# EAGLE design Mouse-112 (EAGLE 9.6.2)
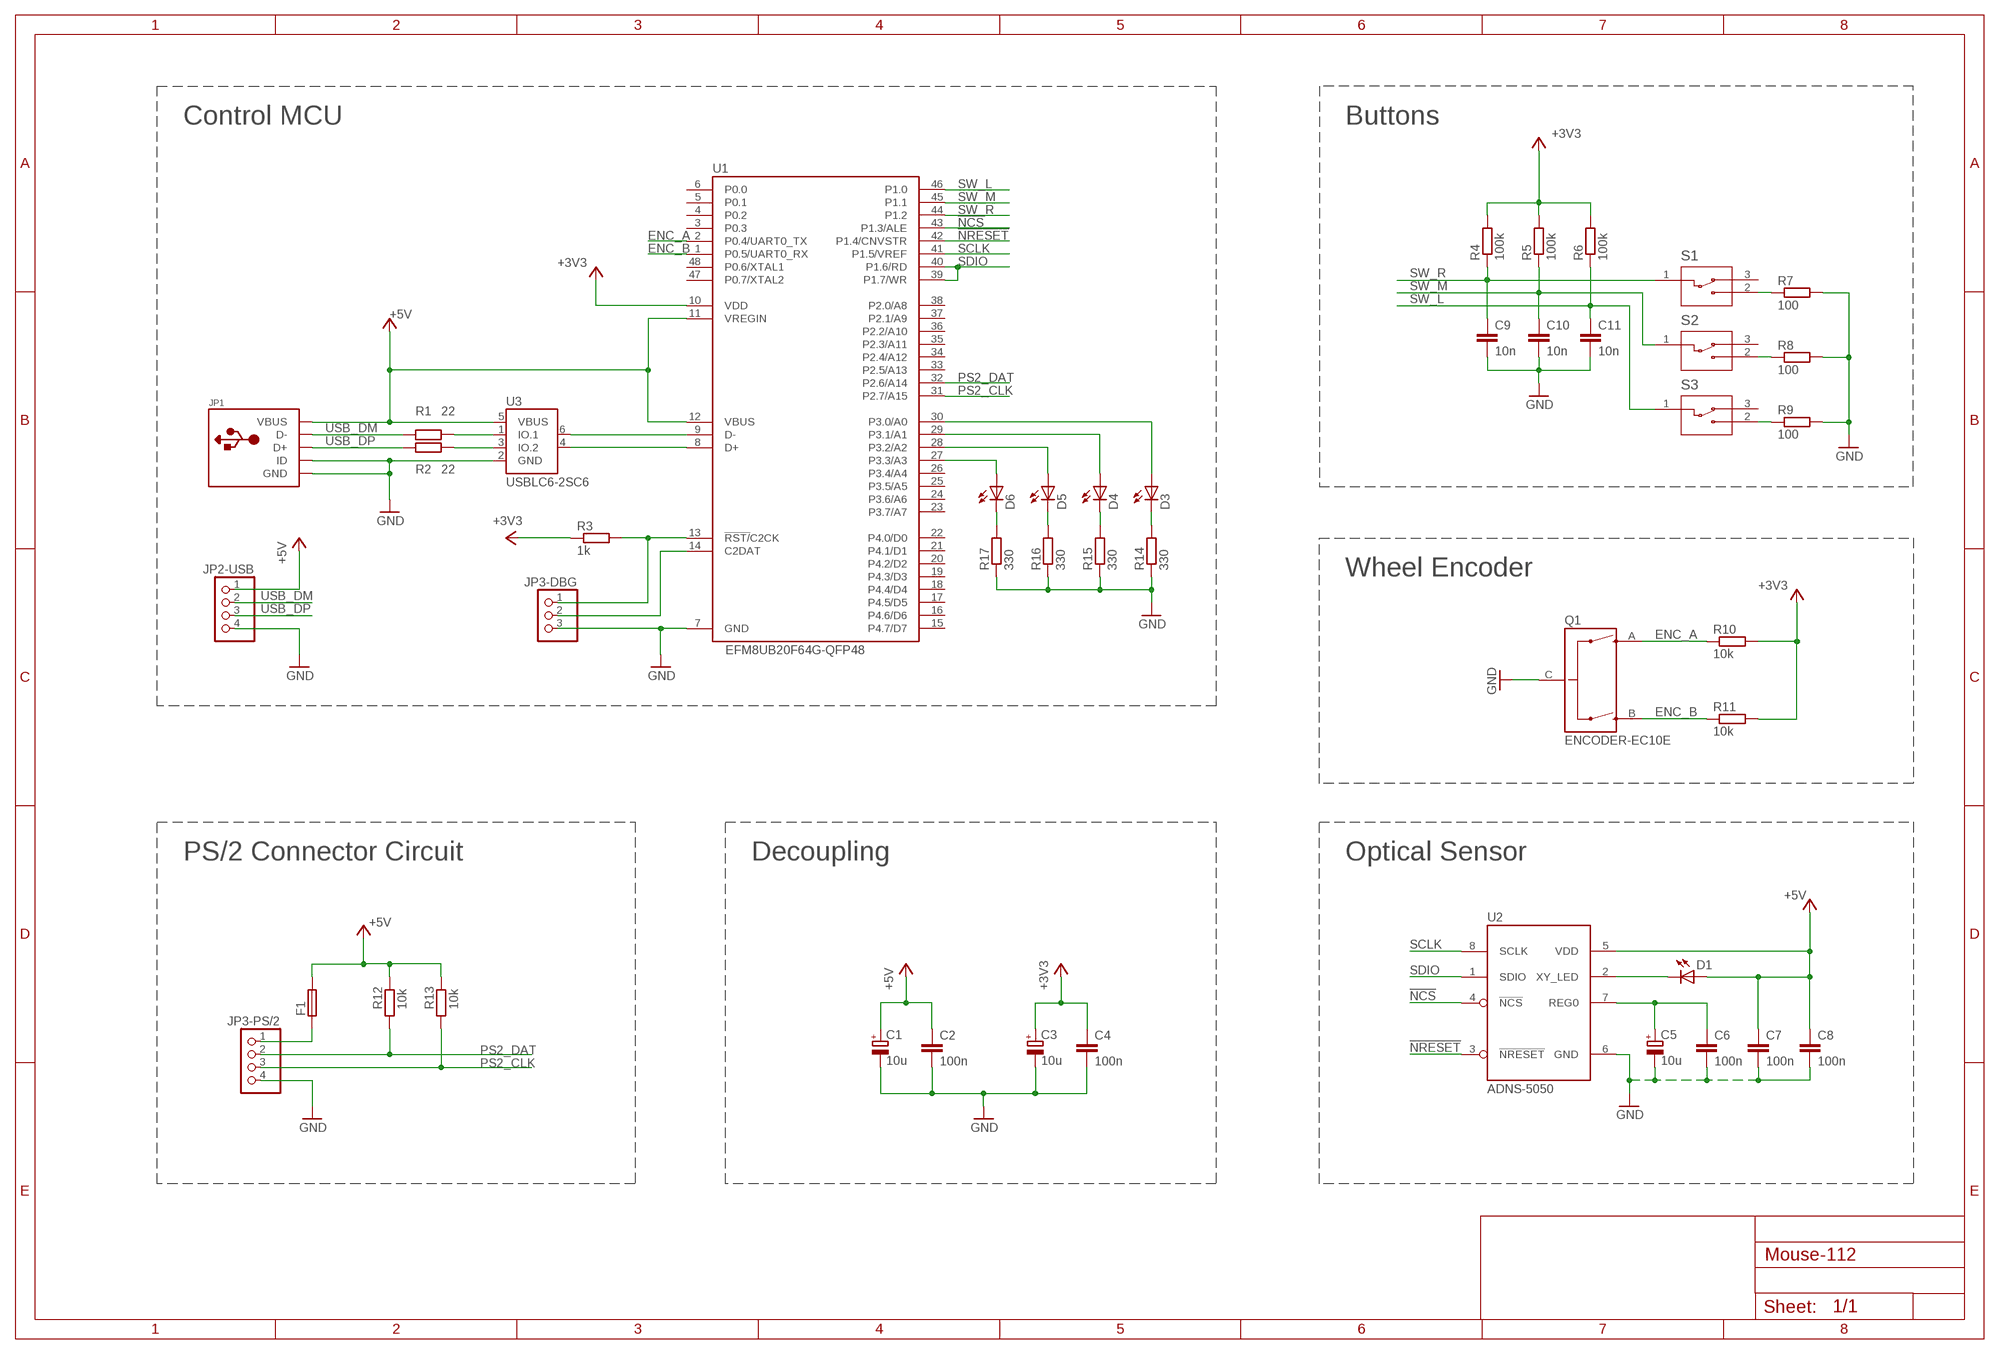
[diagram p0: schematic, sheet 1]

## Parts
C1  10u  CPOL-EU  [RCL-1206F-POL]
C2  100n  C-EU0805  [RCL-0805F]
C3  10u  CPOL-EU  [RCL-1206F-POL]
C4  100n  C-EU0805  [RCL-0805F]
C5  10u  CPOL-EU  [RCL-1206F-POL]
C6  100n  C-EU0805  [RCL-0805F]
C7  100n  C-EU0805  [RCL-0805F]
C8  100n  C-EU0805  [RCL-0805F]
C9  10n  C-EU0805  [RCL-0805F]
C10  10n  C-EU0805  [RCL-0805F]
C11  10n  C-EU0805  [RCL-0805F]
D1  LED5MM  [LED5MM]
D3  LEDLED-0805F  [LED-0805F]
D4  LEDLED-0805F  [LED-0805F]
D5  LEDLED-0805F  [LED-0805F]
D6  LEDLED-0805F  [LED-0805F]
F1  FUSE-NSMF  [RCL-1206F]
JP1  USB-MINI  [USB-MINIB]
JP2-USB  PINHD-1X4  [1X04]
JP3-DBG  PINHD-1X3  [1X03]
JP3-PS/2  PINHD-1X4  [1X04]
Q1  ENCODER-EC10E  [ENCODER-10MM]
R1  22  R-EU0805  [RCL-0805F]
R2  22  R-EU0805  [RCL-0805F]
R3  1k  R-EU0805  [RCL-0805F]
R4  100k  R-EU0805  [RCL-0805F]
R5  100k  R-EU0805  [RCL-0805F]
R6  100k  R-EU0805  [RCL-0805F]
R7  100  R-EU0805  [RCL-0805F]
R8  100  R-EU0805  [RCL-0805F]
R9  100  R-EU0805  [RCL-0805F]
R10  10k  R-EU0805  [RCL-0805F]
R11  10k  R-EU0805  [RCL-0805F]
R12  10k  R-EU0805  [RCL-0805F]
R13  10k  R-EU0805  [RCL-0805F]
R14  330  R-EU0805  [RCL-0805F]
R15  330  R-EU0805  [RCL-0805F]
R16  330  R-EU0805  [RCL-0805F]
R17  330  R-EU0805  [RCL-0805F]
S1  SWITCH-D2F-01  [SWITCH-D2F-01L-12.8X5.8MM]
S2  SWITCH-D2F-01  [SWITCH-D2F-01L-12.8X5.8MM]
S3  SWITCH-D2F-01  [SWITCH-D2F-01L-12.8X5.8MM]
U1  EFM8UB20F64G-QFP48  [QFP48-7X7-0P5MM]
U2  ADNS-5050  [ADNS-5050-DIP-8]
U3  USBLC6-2SC6  [SOT-23-6L]

## Nets
!NCS: U1.43(P1.3/ALE) U2.4(!NCS)
!NRESET: U1.42(P1.4/CNVSTR) U2.3(!NRESET)
+3V3: C3.+ C4.1 R3.1 R4.2 R5.2 R6.2 R10.2 R11.2 U1.10(VDD)
+5V: C1.+ C2.1 C7.1 C8.1 D1.A F1.2 JP1.VBUS JP2-USB.1 R12.2 R13.2 U1.11(VREGIN) U1.12(VBUS) U2.5(VDD) U3.5(VBUS)
C2CK: JP3-DBG.1 R3.2 U1.13(!RST/!C2CK)
C2DAT: JP3-DBG.2 U1.14(C2DAT)
ENC_A: Q1.A R10.1 U1.2(P0.4/UART0_TX)
ENC_B: Q1.B R11.1 U1.1(P0.5/UART0_RX)
GND: C1.- C2.2 C3.- C4.2 C5.- C6.2 C7.2 C8.2 C9.2 C10.2 C11.2 JP1.GND JP1.ID JP2-USB.4 JP3-DBG.3 JP3-PS/2.4 Q1.C R7.2 R8.2 R9.2 R14.1 R15.1 R16.1 R17.1 U1.7(GND) U2.6(GND) U3.2(GND)
N$1: D1.K(C) U2.2(XY_LED)
N$2: D4.A U1.29(P3.1/A1)
N$3: R2.2 U3.3(IO.2)
N$4: R1.2 U3.1(IO.1)
N$5: D3.A U1.30(P3.0/A0)
N$6: D4.C R15.2
N$7: U1.9(D-) U3.6(IO_1)
N$8: U1.8(D+) U3.4(IO_2)
N$9: D3.C R14.2
N$10: F1.1 JP3-PS/2.1
N$11: D5.C R16.2
N$12: R7.1 S1.2
N$13: R8.1 S2.2
N$14: R9.1 S3.2
N$15: D5.A U1.28(P3.2/A2)
N$16: D6.A U1.27(P3.3/A3)
N$17: D6.C R17.2
PS2_CLK: JP3-PS/2.3 R13.1 U1.31(P2.7/A15)
PS2_DAT: JP3-PS/2.2 R12.1 U1.32(P2.6/A14)
REG0: C5.+ C6.1 U2.7(REG0)
SCLK: U1.41(P1.5/VREF) U2.8(SCLK)
SDIO: U1.39(P1.7/WR) U1.40(P1.6/RD) U2.1(SDIO)
SW_L: C11.1 R6.1 S3.1 U1.46(P1.0)
SW_M: C10.1 R5.1 S2.1 U1.45(P1.1)
SW_R: C9.1 R4.1 S1.1 U1.44(P1.2)
USB_DM: JP1.D- JP2-USB.2 R1.1
USB_DP: JP1.D+ JP2-USB.3 R2.1
Unconnected: S1.3 S2.3 S3.3 U1.3(P0.3) U1.4(P0.2) U1.5(P0.1) U1.6(P0.0) U1.15(P4.7/D7) U1.16(P4.6/D6) U1.17(P4.5/D5) U1.18(P4.4/D4) U1.19(P4.3/D3) U1.20(P4.2/D2) U1.21(P4.1/D1) U1.22(P4.0/D0) U1.23(P3.7/A7) U1.24(P3.6/A6) U1.25(P3.5/A5) U1.26(P3.4/A4) U1.33(P2.5/A13) U1.34(P2.4/A12) U1.35(P2.3/A11) U1.36(P2.2/A10) U1.37(P2.1/A9) U1.38(P2.0/A8) U1.47(P0.7/XTAL2) U1.48(P0.6/XTAL1)

## Notes on the sheet
- Control MCU | Buttons
- Wheel Encoder
- PS/2 Connector Circuit | Decoupling | Optical Sensor

## Library data of the parts
C1 C3 C5 = MakBit:CPOL-EU: Polarized capacitor Tantalum SMD 3215, Electrolytic D: 5mm (10uF 50V), 6mm (100uF 9V), 7mm, 10mm (10uF 400V), 13mm (22uF 400V)
C2 C4 C6-C11 = MakBit:C-EU: SMD & PTH Capacitor
D1 = led:LED: LED OSRAM: - CHIPLED LG R971, LG N971, LY N971, LG Q971, LY Q971, LO R971, LY R971 LH N974, LH R974 LS Q976, LO Q976, LY Q976 LO Q996 - Hyper CHIPLED LW Q18S LB Q993, LB Q99A, LB R99A - SideLED LS A670, LO A670, LY A670, LG A670, LP A670 LB A673, LV A673, LT A673, LW A673 LH A674 LY A675 LS A676, LA A676, LO A676, LY A676, LW A676 LS A679, LY A679, LG A679 - Hyper Micro SIDELED® LS Y876, LA Y876, LO Y876, LY Y876 LT Y87S - SmartLED LW L88C, LW L88S LB L89C, LB L89S, LG L890 LS L89K, LO L89K, LY L89K LS L896, LA L896, LO L896, LY L896 - TOPLED LS T670, LO T670, LY T670, LG T670, LP T670 LSG T670, LSP T670, LSY T670, LOP T670, LYG T670 LG T671, LOG T671, LSG T671 LB T673, LV T673, LT T673, LW T673 LH T674 LS T676, LA T676, LO T676, LY T676, LB T676, LH T676, LSB T676, LW T676 LB T67C, LV T67C, LT T67C, LS T67K, LO T67K, LY T67K, LW E67C LS E67B, LA E67B, LO E67B, LY E67B, LB E67C, LV E67C, LT E67C LW T67C LS T679, LY T679, LG T679 LS T770, LO T770, LY T770, LG T770, LP T770 LB T773, LV T773, LT T773, LW T773 LH T774 LS E675, LA E675, LY E675, LS T675 LS T776, LA T776, LO T776, LY T776, LB T776 LHGB T686 LT T68C, LB T68C - Hyper Mini TOPLED® LB M676 - Mini TOPLED Santana® LG M470 LS M47K, LO M47K, LY M47K Source: http://www.osram.convergy.de LUXEON: - LUMILED® LXK2-PW12-R00, LXK2-PW12-S00, LXK2-PW14-U00, LXK2-PW14-V00 LXK2-PM12-R00, LXK2-PM12-S00, LXK2-PM14-U00 LXK2-PE12-Q00, LXK2-PE12-R00, LXK2-PE12-S00, LXK2-PE14-T00, LXK2-PE14-U00 LXK2-PB12-K00, LXK2-PB12-L00, LXK2-PB12-M00, LXK2-PB14-N00, LXK2-PB14-P00, LXK2-PB14-Q00 LXK2-PR12-L00, LXK2-PR12-M00, LXK2-PR14-Q00, LXK2-PR14-R00 LXK2-PD12-Q00, LXK2-PD12-R00, LXK2-PD12-S00 LXK2-PH12-R00, LXK2-PH12-S00 LXK2-PL12-P00, LXK2-PL12-Q00, LXK2-PL12-R00 Source: www.luxeon.com KINGBRIGHT: KA-3528ASYC Source: www.kingbright.com
D3-D6 = MakBit:LED: LEDs Standard schematic elements and footprints for 5mm, 3mm, 0805, 1206 LEDs.
F1 = MakBit:FUSE-NSMF: Bourns MF-NSMF Series - PRC Resettable Fuses USB port protection - USB 2.0, 3.0 HDMI 1.4 Source protection PC motherboards - Plug and Play protection Mobile phones - Battery and port protection PDAs / digital cameras
JP1 = MakBit:USB-MINI: USB Mini-B SMD Connector
JP2-USB JP3-PS/2 = pinhead:PINHD-1X4: PIN HEADER
JP3-DBG = pinhead:PINHD-1X3: PIN HEADER
Q1 = MakBit:ENCODER-EC10E: EC10E - A series of compact and long-life encoders with unique through shaft design.
R1-R17 = MakBit:R-EU: SMD & Through-hole Resistor
S1-S3 = MakBit:SWITCH-D2F-01: Omron Basic Switch D2F 12.8 x 5.8 x 6.5 mm D2F-01, D2F-T, etc
U1 = MakBit:EFM8UB20F64G-QFP48: EFM8UB2 - is a multi-purpose 8-bit MCU with USB feature set. <http://www.silabs.com/Support%20Documents/TechnicalDocs/efm8ub2-datasheet.pdf> CPU: 8051 @48MHz, 32 or 64 kB Flash, 2 or 4 kB RAM Communication: SPI, 2 SMBus/I2C, 2 UART, EMIF, USB 2.0 FullSpeed, 10-bit ADC, 40 I/O ports Package: QFP48 7x7mm, 5V tolerant.; MFG: Silicon Laboratories; PACKAGE: QFP-48
U2 = MakBit:ADNS-5050: The ADNS-5050 is a mainstream, small form factor optical mouse sensor. High speed motion detection at 30 ips and up to 8g Default 500 cpi resolution, adjustable from 125 to 1375 cpi Self-adjusting frame rate for optimum performance Internal oscillator – no clock input needed Operating voltage: 5V nominal
U3 = MakBit:USBLC6-2SC6: VERY LOW CAPACITANCE ESD PROTECTION 2 line 2 data-line protection Protects VBUS Very low capacitance: 3.5 pF max. Very low leakage current: 150 nA max Datasheet link <http://www.st.com/web/catalog/sense_power/FM114/CL1137/SC1489/PF93353>

## Board
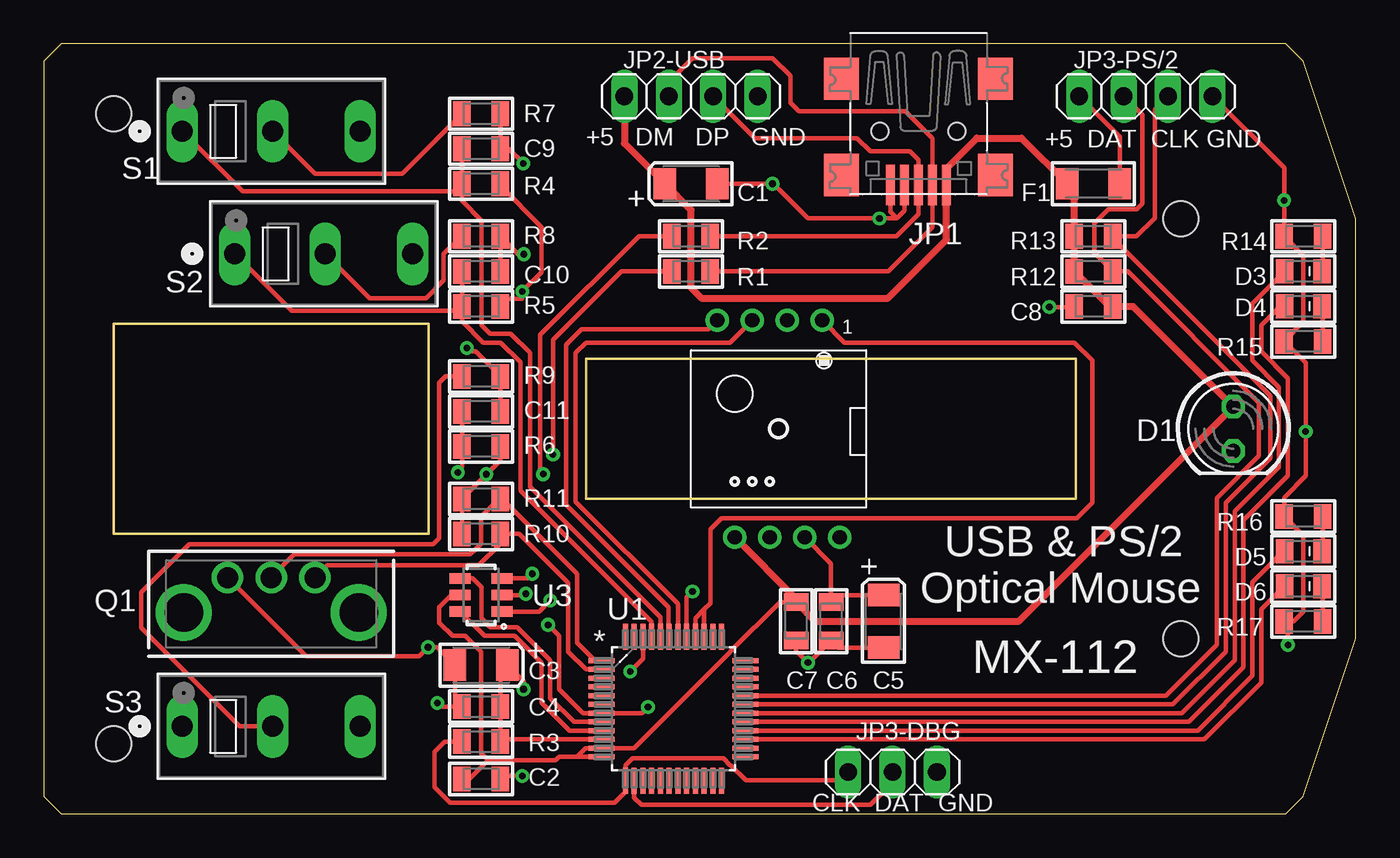
[diagram p1: board, top side]
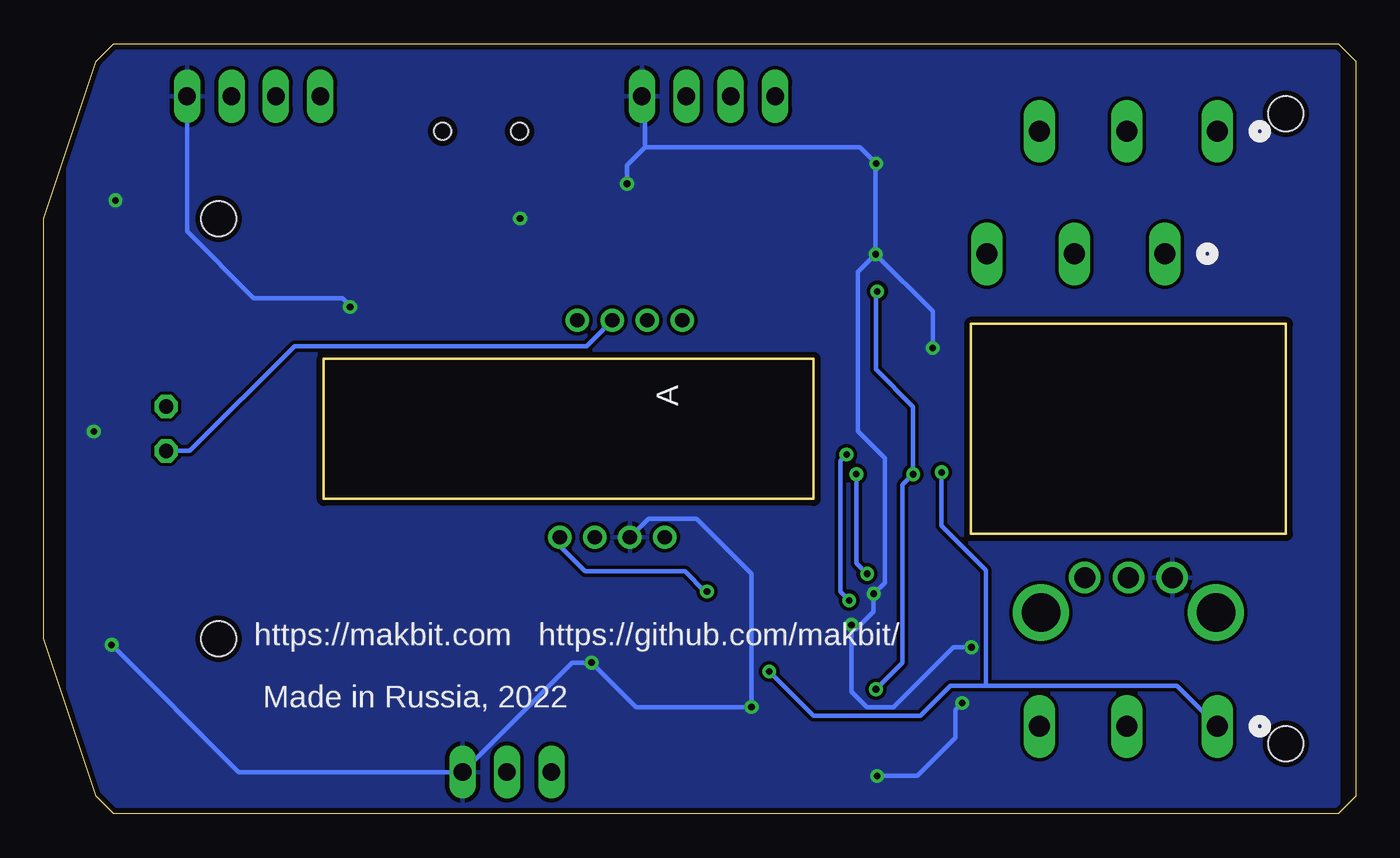
[diagram p2: board, bottom side, seen from below]

Size 75 x 44 mm. Coordinates in mm from the lower left corner, seen from the top.
Outline: 1,0 71,0 72,1 75,10 75,34 72,43 71,44 1,44 0,43 0,1 1,0
Outline: 4,16 4,28 22,28 22,16 4,16
Outline: 31,26 31,18 59,18 59,26 31,26
Copper layers (1*16): Top 0.035mm / dielectric 1.5mm / Bottom 0.035mm
Design rules "Mouse-112 *": minimum track width 0.2mm, minimum drill 0.35mm, track to track 0.205mm, track to pad 0.205mm, pad to pad 0.205mm, via to via 0.205mm, smd to smd 6mil, copper to edge 0.32mm, drill to drill 6mil, minimum pad ring 10mil, minimum via ring 8mil, stop-mask expansion 4mil, vias tented up to drill 0.5mm, thermal gap 10mil
Holes 2 mm at 4,40 4,4 65,34 65,10

### Footprints (pad centres in the part's own frame; a part is rotated, then mirrored left to right if it is on the bottom)
RCL-1206F-POL = smd 1.3 x 1.8: + 1.5,0; - -1.5,0
RCL-0805F = smd 1 x 1.4: 1 -1.1,0; 2 1.1,0
LED5MM = drill 0.813 octagon: A -1.27,0; K 1.27,0
LED-0805F = smd 1.016 x 1.397: A -1.067,0; C 1.067,0
RCL-1206F = smd 1.3 x 1.8: 1 -1.5,0; 2 1.5,0
USB-MINIB = smd 0.5 x 2.308: D+ 0,4.064; D- -0.8,4.064; GND 1.6,4.064; ID 0.8,4.064; VBUS -1.6,4.064 | smd 2 x 2.4: GND1 -4.4,-2; GND2 -4.4,3.5; GND3 4.4,3.5; GND4 4.4,-2 | hole 1: -2.2,1; 2.2,1
1X04 = drill 1.016 long: 1 -3.81,0; 2 -1.27,0; 3 1.27,0; 4 3.81,0
1X03 = drill 1.016 long: 1 -2.54,0; 2 0,0; 3 2.54,0
ENCODER-10MM = drill 1.2: A -2.5,0; B 0,0; C 2.5,0 | drill 2.2: P$1 -5,2; P$2 5,2
SWITCH-D2F-01L-12.8X5.8MM = drill 1.2 long: 1 -5.08,0; 2 0.08,0; 3 5.08,0
QFP48-7X7-0P5MM = smd 1.473 x 0.279: 1 -4.115,2.75; 2 -4.115,2.25; 3 -4.115,1.75; 4 -4.115,1.25; 5 -4.115,0.75; 6 -4.115,0.25; 7 -4.115,-0.25; 8 -4.115,-0.75; 9 -4.115,-1.25; 10 -4.115,-1.75; 11 -4.115,-2.25; 12 -4.115,-2.75; 25 4.115,-2.75; 26 4.115,-2.25; 27 4.115,-1.75; 28 4.115,-1.25; 29 4.115,-0.75; 30 4.115,-0.25; 31 4.115,0.25; 32 4.115,0.75; 33 4.115,1.25; 34 4.115,1.75; 35 4.115,2.25; 36 4.115,2.75 | smd 0.279 x 1.473: 13 -2.75,-4.115; 14 -2.25,-4.115; 15 -1.75,-4.115; 16 -1.25,-4.115; 17 -0.75,-4.115; 18 -0.25,-4.115; 19 0.25,-4.115; 20 0.75,-4.115; 21 1.25,-4.115; 22 1.75,-4.115; 23 2.25,-4.115; 24 2.75,-4.115; 37 2.75,4.115; 38 2.25,4.115; 39 1.75,4.115; 40 1.25,4.115; 41 0.75,4.115; 42 0.25,4.115; 43 -0.25,4.115; 44 -0.75,4.115; 45 -1.25,4.115; 46 -1.75,4.115; 47 -2.25,4.115; 48 -2.75,4.115
ADNS-5050-DIP-8 = drill 0.813: 1 -2.5,-6.2; 2 -0.5,-6.2; 3 1.5,-6.2; 4 3.5,-6.2; 5 2.5,6.2; 6 0.5,6.2; 7 -1.5,6.2; 8 -3.5,6.2
SOT-23-6L = smd 0.6 x 1.2: 1 -0.95,-1.2; 2 0,-1.2; 3 0.95,-1.2; 4 0.95,1.2; 5 0,1.2; 6 -0.95,1.2

### Placement (x,y rotation side)
C1  37,36 180 top
C2  25,2 0 top
C3  25,8.5 0 top
C4  25,6.13 180 top
C5  48,11 90 top
C6  45,11 270 top
C7  43,11 270 top
C8  60,29 180 top
C9  25,38 0 top
C10  25,31 0 top
C11  25,23 0 top
D1  68,22 270 top
D3  72,31 0 top
D4  72,29 0 top
D5  72,15 0 top
D6  72,13 0 top
F1  60,36 180 top
JP1  50,40 180 top
JP2-USB  37,41 0 top
JP3-DBG  48.52,2.38 0 top
JP3-PS/2  63,41 0 top
Q1  13,13.5 180 top
R1  37,31 180 top
R2  37,33 180 top
R3  25,4.13 180 top
R4  25,36 0 top
R5  25,29 0 top
R6  25,21 0 top
R7  25,40 0 top
R8  25,33 0 top
R9  25,25 0 top
R10  25,16 180 top
R11  25,18 180 top
R12  60,31 180 top
R13  60,33 180 top
R14  72,33 0 top
R15  72,27 0 top
R16  72,17 0 top
R17  72,11 0 top
S1  13,39 0 top
S2  16,32 0 top
S3  13,5 0 top
U1  36,6 0 top
U2  42,22 180 top
U3  25,12.5 90 top

### Tracks (layer width: path | path; a pad name or v marks a point on that pad's centre or on a via)
!NCS
  Top 0.254: U1.43 35.72,10.14 35.72,11.79 29.84,17.67 29.84,26.8 30.73,27.69 37.99,27.69 U2.4
!NRESET
  Top 0.254: U1.42 36.25,11.99 30.4,17.84 30.4,26.33 30.99,26.92 39.22,26.92 U2.3
+3V3  (via drill 0.38)
  Top 0.254: R5.2 26.52,29.42 27.35,29.42 v27.35,29.85 28.46,30.96 28.46,33.51 26.1,35.88 R4.2 | U1.10 26.22,4.25 R3.1 C4.1 26.1,8.1 C3.+ 27.43,7.57 v27.43,7.11 | R10.2 R11.2 v25.3,19.4 26.1,20.2 R6.2
  Bottom 0.254: v27.43,7.11 25.91,8.64 25.91,18.8 v25.3,19.4 25.3,23.27 27.43,25.4 27.43,29.92 v27.35,29.85
+5V
  Top 0.254: U3.5 23.3,12.5 22.61,11.81 22.61,10.92 23.37,10.16 24.08,10.16 24.99,9.25 24.99,3.45 25.4,3.05 | 25.4,3.05 29.26,3.05 29.46,3.25 30.48,3.25 | U1.12 30.48,3.25 | 30.48,3.25 30.98,3.75 U1.11 33.73,3.75 39.22,9.24 39.22,9.25 42.07,12.1 C7.1 | C2.1 24.35,2 25.4,3.05 | 43,12.3 C7.1 | C7.1 43.04,12.06
  Top 0.406: JP2-USB.1 33.19,38.31 C1.+ 37.01,34.49 37.01,30.05 37.59,29.46 48.26,29.46 51.6,32.8 JP1.VBUS 51.6,36.87 53.34,38.61 55.89,38.61 F1.2 58.9,35.6 R13.2 R12.2 60.9,29 C8.1 62.27,29 D1.A 55.7,10.97 44.13,10.97 43.04,12.06 | U2.5 43,12.3
C2CK
  Top 0.254: R3.2 22.92,4.13 22.35,3.56 22.35,1.52 23.24,0.64 32.64,0.64 33.25,1.25 U1.13 33.25,2.77 33.66,3.17 38.84,3.17 39.24,2.78 39.26,2.78 40.13,1.91 45.51,1.91 JP3-DBG.1
C2DAT
  Top 0.254: U1.14 33.75,0.92 34.16,0.51 47.24,0.51 48.52,1.79 JP3-DBG.2
ENC_A
  Top 0.254: Q1.A 16.19,14.19 24.86,14.19 26.1,15.43 R10.1 27.18,16 29.97,13.21 29.97,9.27 30.99,8.25 U1.2
ENC_B
  Top 0.254: Q1.B 14.33,14.83 24.38,14.83 24.52,14.97 24.54,14.97 24.99,15.42 24.99,16.97 26.03,18 R11.1 26.2,18 30.48,13.72 30.48,9.77 31.5,8.75 U1.1
GND  (via drill 0.38)
  Top 0.254: v27.45,31.97 27.13,31.97 R8.2 C10.2 26.04,30.93 | 49.26,35.88 JP1.ID 49.2,34.47 48.77,34.04 | 48.77,34.04 48.4,34.4 JP1.GND | v47.77,34.02 47.78,34.04 | 47.78,34.04 48.77,34.04 | C1.- v41.66,36 41.72,36 43.69,34.04 47.78,34.04 | R15.1 72.01,28.11 72.01,31.89 R14.1 v70.9,35.05 70.9,36.91 JP3-PS/2.4 | 71.12,26.78 R15.1 | v71.12,9.65 71.12,10.78 R17.1 71.45,11 72.01,11.56 72.01,15.89 R16.1 70.9,18.07 72.14,19.3 v72.14,21.84 72.14,25.76 R15.1 | U3.2 27.49,12.5 v27.56,12.57 | v28.83,10.79 29.46,10.16 29.46,7.11 30.83,5.75 U1.7 34.2,5.75 v34.54,6.1 | C5.- 45.4,9.5 C6.2 43.74,8.64 v43.69,8.64 43,9.32 C7.2 | R7.2 C9.2 26.58,38 v27.42,37.16 | C11.2 R9.2 24.68,26.42 24.38,26.42 v24.18,26.62 | C2.2 26.26,2.16 v27.35,2.16 | v22.5,6.33 22.7,6.13 C4.2 23.5,6.53 C3.- 22.48,9.52 v21.97,9.52 21.46,9.01 14.99,9.01 Q1.C | C8.2 58.86,28.96 v57.48,28.96
  Bottom 0.254: v27.45,31.97 27.45,37.13 v27.42,37.16 28.34,38.08 40.64,38.08 | JP2-USB.4 40.64,40.83 40.64,38.08 | v71.12,9.65 63.85,2.38 JP3-DBG.3 44.81,8.64 v43.69,8.64 41.15,6.1 v34.54,6.1 34.54,13.72 37.69,16.87 40.43,16.87 U2.6 | v27.35,2.16 25.07,2.16 22.88,4.35 22.88,5.95 v22.5,6.33 | JP3-PS/2.4 66.81,33.28 62.99,29.46 57.91,29.46 57.48,29.04 v57.48,28.96 | v24.18,26.62 24.18,28.7 v27.45,31.97 | 40.64,38.08 41.66,37.07 v41.66,36 | v21.97,9.52 23,9.52 26.42,6.1 27.94,6.1 28.83,6.99 v28.83,10.79 28.57,10.54 27.56,11.56 v27.56,12.57 26.92,13.21 26.92,20.32 28.45,21.84 28.45,30.97 v27.45,31.97
  pour Bottom: 1,0.08 1,43.8 73.59,43.8 73.59,0.08
N$1
  Bottom 0.254: U2.2 43.98,26.72 60.66,26.72 66.65,20.73 D1.K
N$2
  Top 0.254: U1.29 65.45,5.25 68.58,8.38 68.58,16.76 71.12,19.3 71.12,24.89 69.6,26.42 69.6,27.92 70.67,29 D4.A
N$3  (via drill 0.38)
  Top 0.254: R2.2 34.02,33 28.38,27.37 28.38,19.57 v28.55,19.41 | v27.93,13.71 27.67,13.45 U3.3
  Bottom 0.254: v27.93,13.71 28.55,14.33 v28.55,19.41
N$4  (via drill 0.38)
  Top 0.254: R1.2 33.03,31 29.11,27.08 v29.11,20.52 | v28.96,12.19 28.31,11.55 U3.1
  Bottom 0.254: v28.96,12.19 29.46,12.7 29.46,20.17 v29.11,20.52
N$5
  Top 0.254: U1.30 65.06,5.75 68.07,8.76 68.07,17.27 70.61,19.81 70.61,24.38 69.09,25.91 69.09,29.16 D3.A
N$6
  Top 0.254: D4.C 73.1,28.97 R15.2
N$7
  Top 0.254: U1.9 30.05,4.75 28.45,6.35 28.45,8.64 26.92,10.16 25.19,10.16 U3.6
N$8
  Top 0.254: U1.8 30.31,5.25 28.96,6.6 28.96,8.78 27.07,10.67 25.53,10.67 25.02,11.18 25.02,12.95 24.52,13.45 U3.4
N$9
  Top 0.254: R14.2 73.1,31.03 D3.C
N$10
  Top 0.254: JP3-PS/2.1 61.5,38.69 F1.1
N$11
  Top 0.254: R16.2 73.1,15.03 D5.C
N$12
  Top 0.254: S1.2 15.5,36.58 20.48,36.58 R7.1
N$13
  Top 0.254: S2.2 18.62,29.46 21.84,29.46 22.86,30.48 22.86,31.99 23.87,33 R8.1
N$14
  Top 0.254: S3.2 11.21,5 5.57,10.64 5.57,12.67 8.3,15.4 22.25,15.4 22.6,15.75 22.6,24.64 22.97,25 R9.1
N$15
  Top 0.254: U1.28 65.96,4.75 69.09,7.87 69.09,13.22 70.86,15 D5.A
N$16
  Top 0.254: U1.27 66.35,4.25 69.6,7.49 69.6,11.68 70.91,13 D6.A
N$17
  Top 0.254: D6.C 73.1,12.97 R17.2
PS2_CLK
  Top 0.254: U1.31 64.54,6.25 67.56,9.27 67.56,17.78 70.1,20.32 70.1,23.88 61.1,32.88 R13.1 62.46,33 63.5,34.04 63.5,40.23 JP3-PS/2.3
PS2_DAT
  Top 0.254: U1.32 64.15,6.75 67.06,9.65 67.06,18.03 69.47,20.45 69.47,23.5 61.96,31 R12.1 60.05,32.05 60.05,33.73 60.86,34.54 62.48,34.54 62.79,34.85 62.79,39.94 JP3-PS/2.2
REG0
  Top 0.254: U2.7 45,14.3 C6.1 45.4,12.5 C5.+
SCLK  (via drill 0.38)
  Top 0.254: U1.41 36.75,12.37 v37.08,12.7
  Bottom 0.254: v37.08,12.7 37.21,12.7 38.35,13.84 44.05,13.84 45.5,15.29 U2.8
SDIO
  Top 0.254: U2.1 45.78,26.92 58.93,26.92 59.94,25.91 59.94,17.78 59.05,16.89 38.73,16.89 38.1,16.26 38.1,12.03 37.75,11.68 | U1.39 37.75,11.68 | U1.40 37.25,11.18 37.75,11.68
SW_L  (via drill 0.38)
  Top 0.254: U1.46 34.25,8.85 v33.53,8.13 | C11.1 R6.1 23.9,19.84 23.67,19.61 v23.67,19.51
  Bottom 0.254: v33.53,8.13 30.99,5.59 24.89,5.59 23.16,7.32 21.13,7.32 | v23.67,19.51 23.67,16.46 21.13,13.92 21.13,7.32 | S3.1 10.23,7.32 21.13,7.32
SW_M
  Top 0.254: C10.1 R5.1 | R5.1 23.9,28.14 25.11,26.92 26.13,26.92 27.25,25.8 27.25,18.47 34.75,10.97 U1.45 | R5.1 23.65,28.75 14.17,28.75 S2.1
SW_R
  Top 0.254: U1.44 35.25,11.23 27.79,18.69 27.79,26.33 26.69,27.43 25.51,27.43 25.04,27.9 25.04,33.89 23.9,35.03 R4.1 | S1.1 11.36,35.56 23.46,35.56 R4.1 | C9.1 R4.1
USB_DM
  Top 0.254: JP2-USB.2 35.73,41.83 37.08,43.18 41.66,43.18 42.67,42.16 42.67,40.64 43.18,40.13 49.26,40.13 50.8,38.59 50.8,36.07 JP1.D- 50.8,33.53 48.27,31 R1.1
USB_DP
  Top 0.254: JP2-USB.3 40.66,38.61 46.49,38.61 47.25,37.85 49.51,37.85 50,37.36 50,36.07 JP1.D+ 50,34.25 48.75,33 R2.1

### Text on the board
tPlace: +5 DM DP GND | +5 DAT CLK GND | 1 | USB & PS/2 / Optical Mouse | MX-112 | CLK DAT GND
bPlace: https://makbit.com https://github.com/makbit/ | Made in Russia, 2022